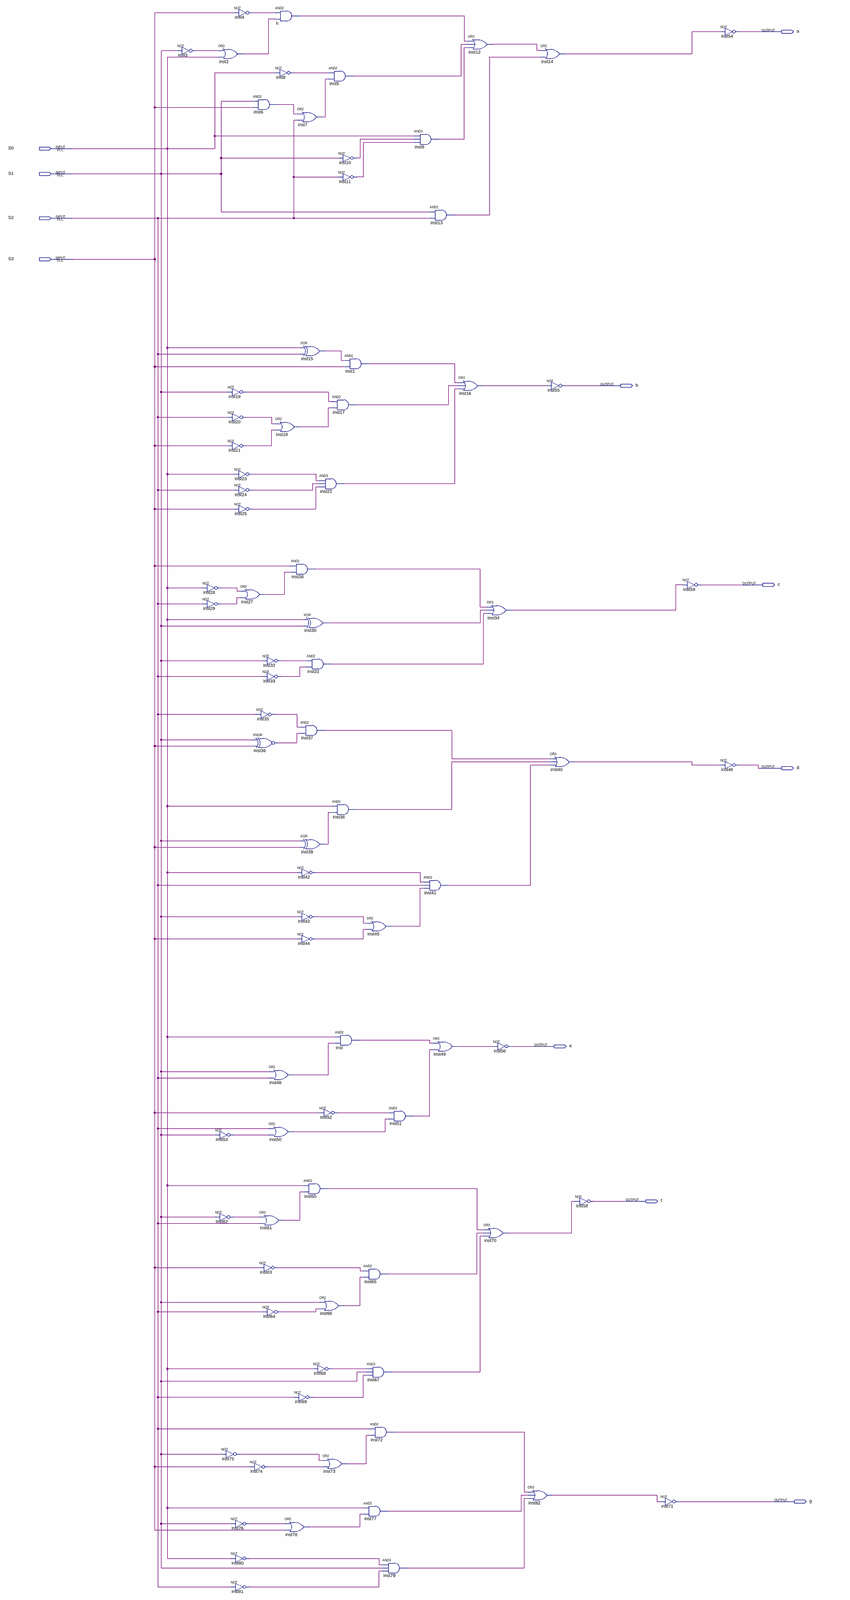
[diagram p0: schematic sheet, whole]
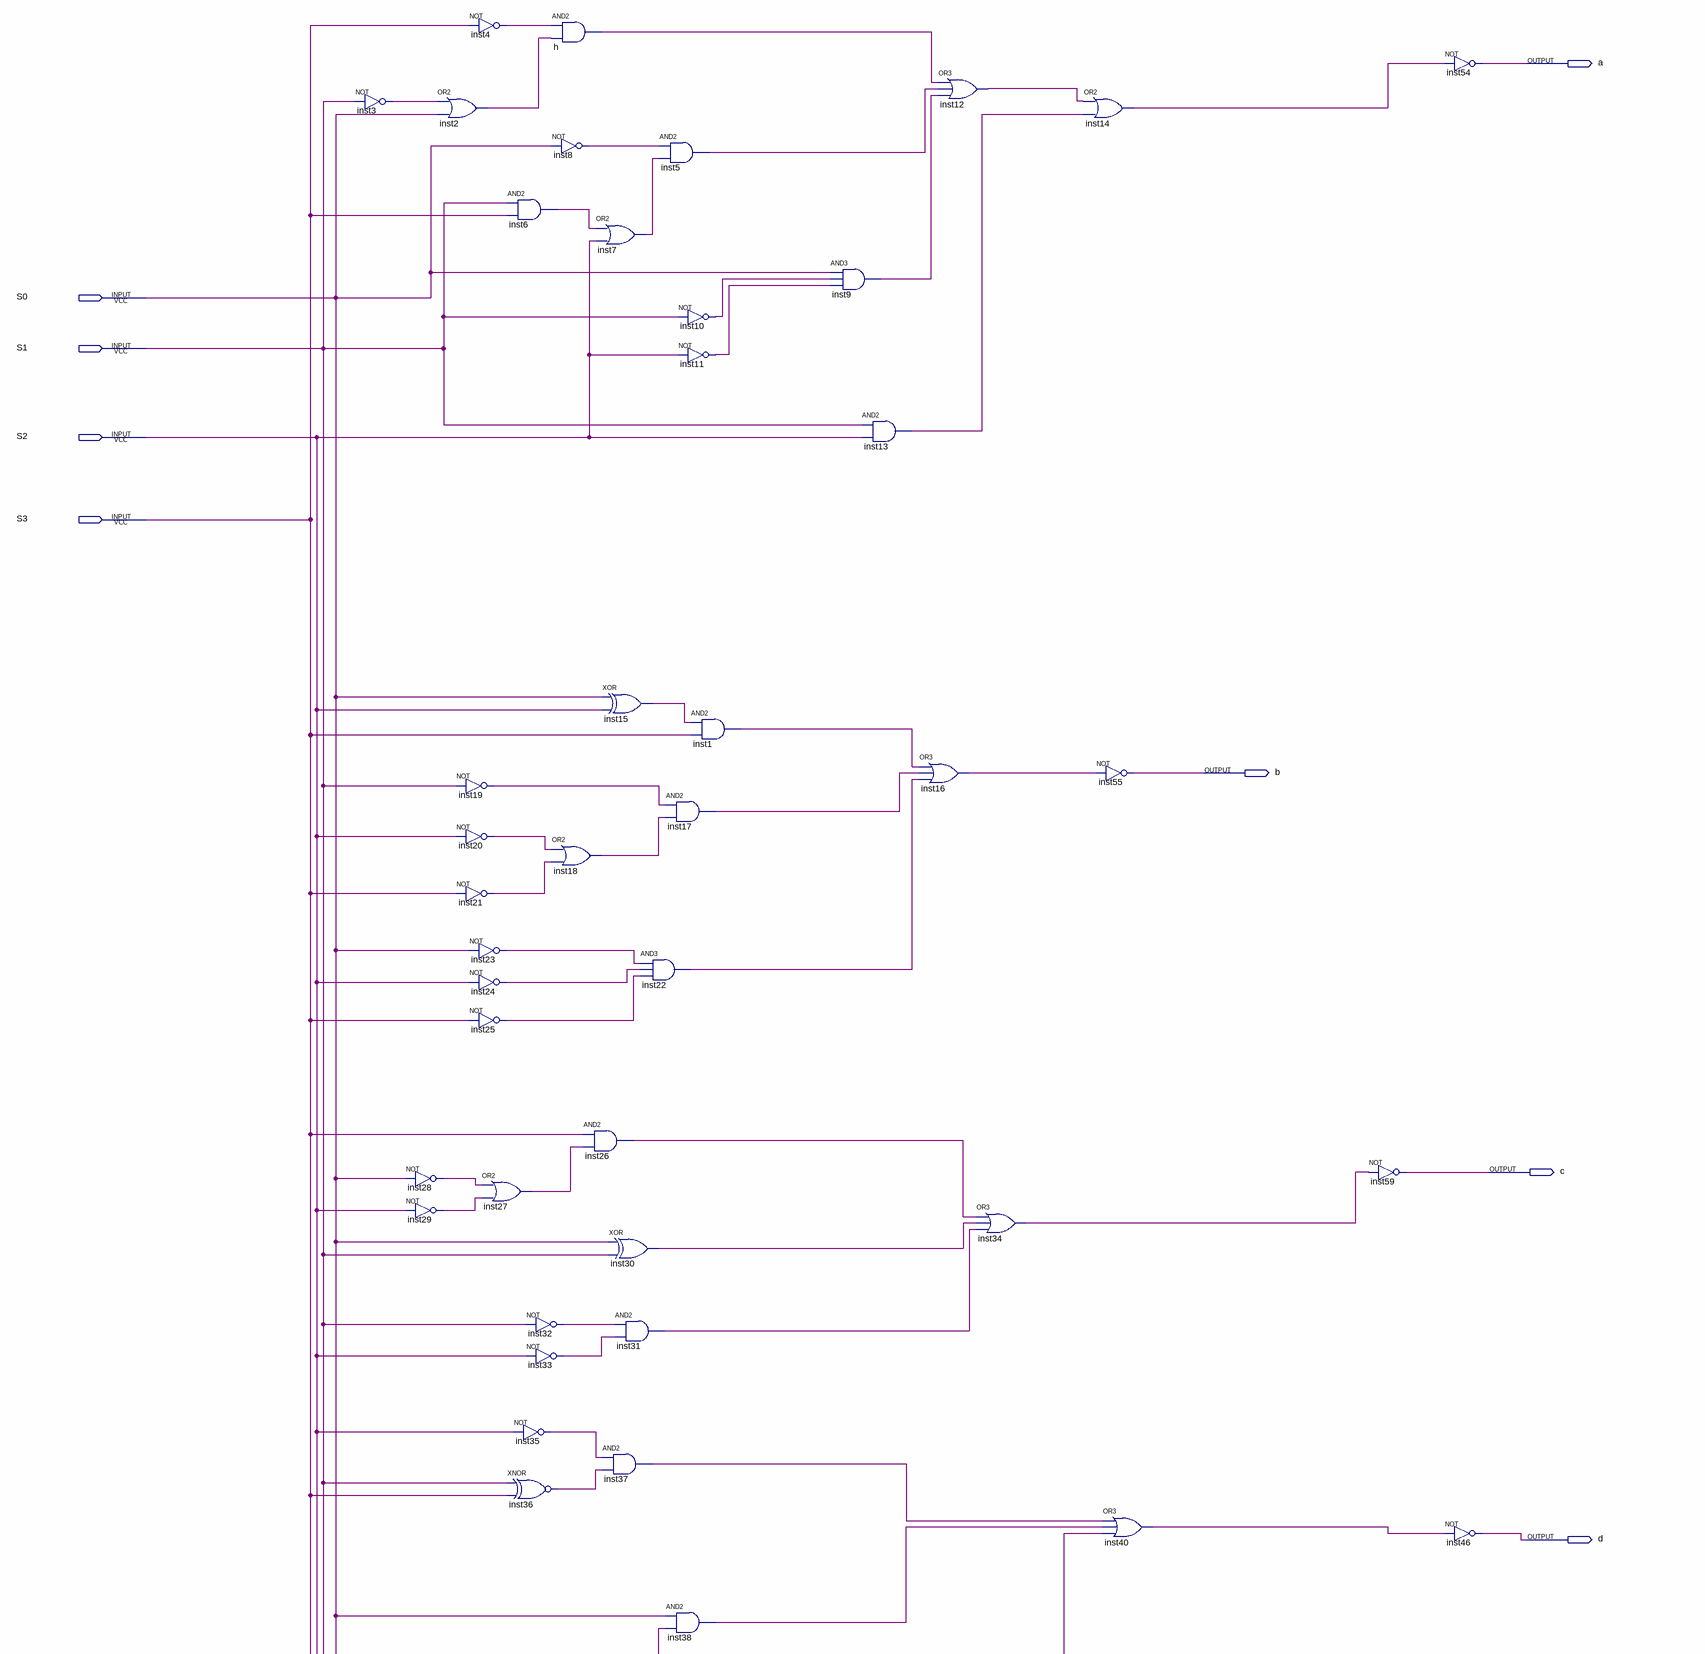
[diagram p1: schematic sheet, upper part]
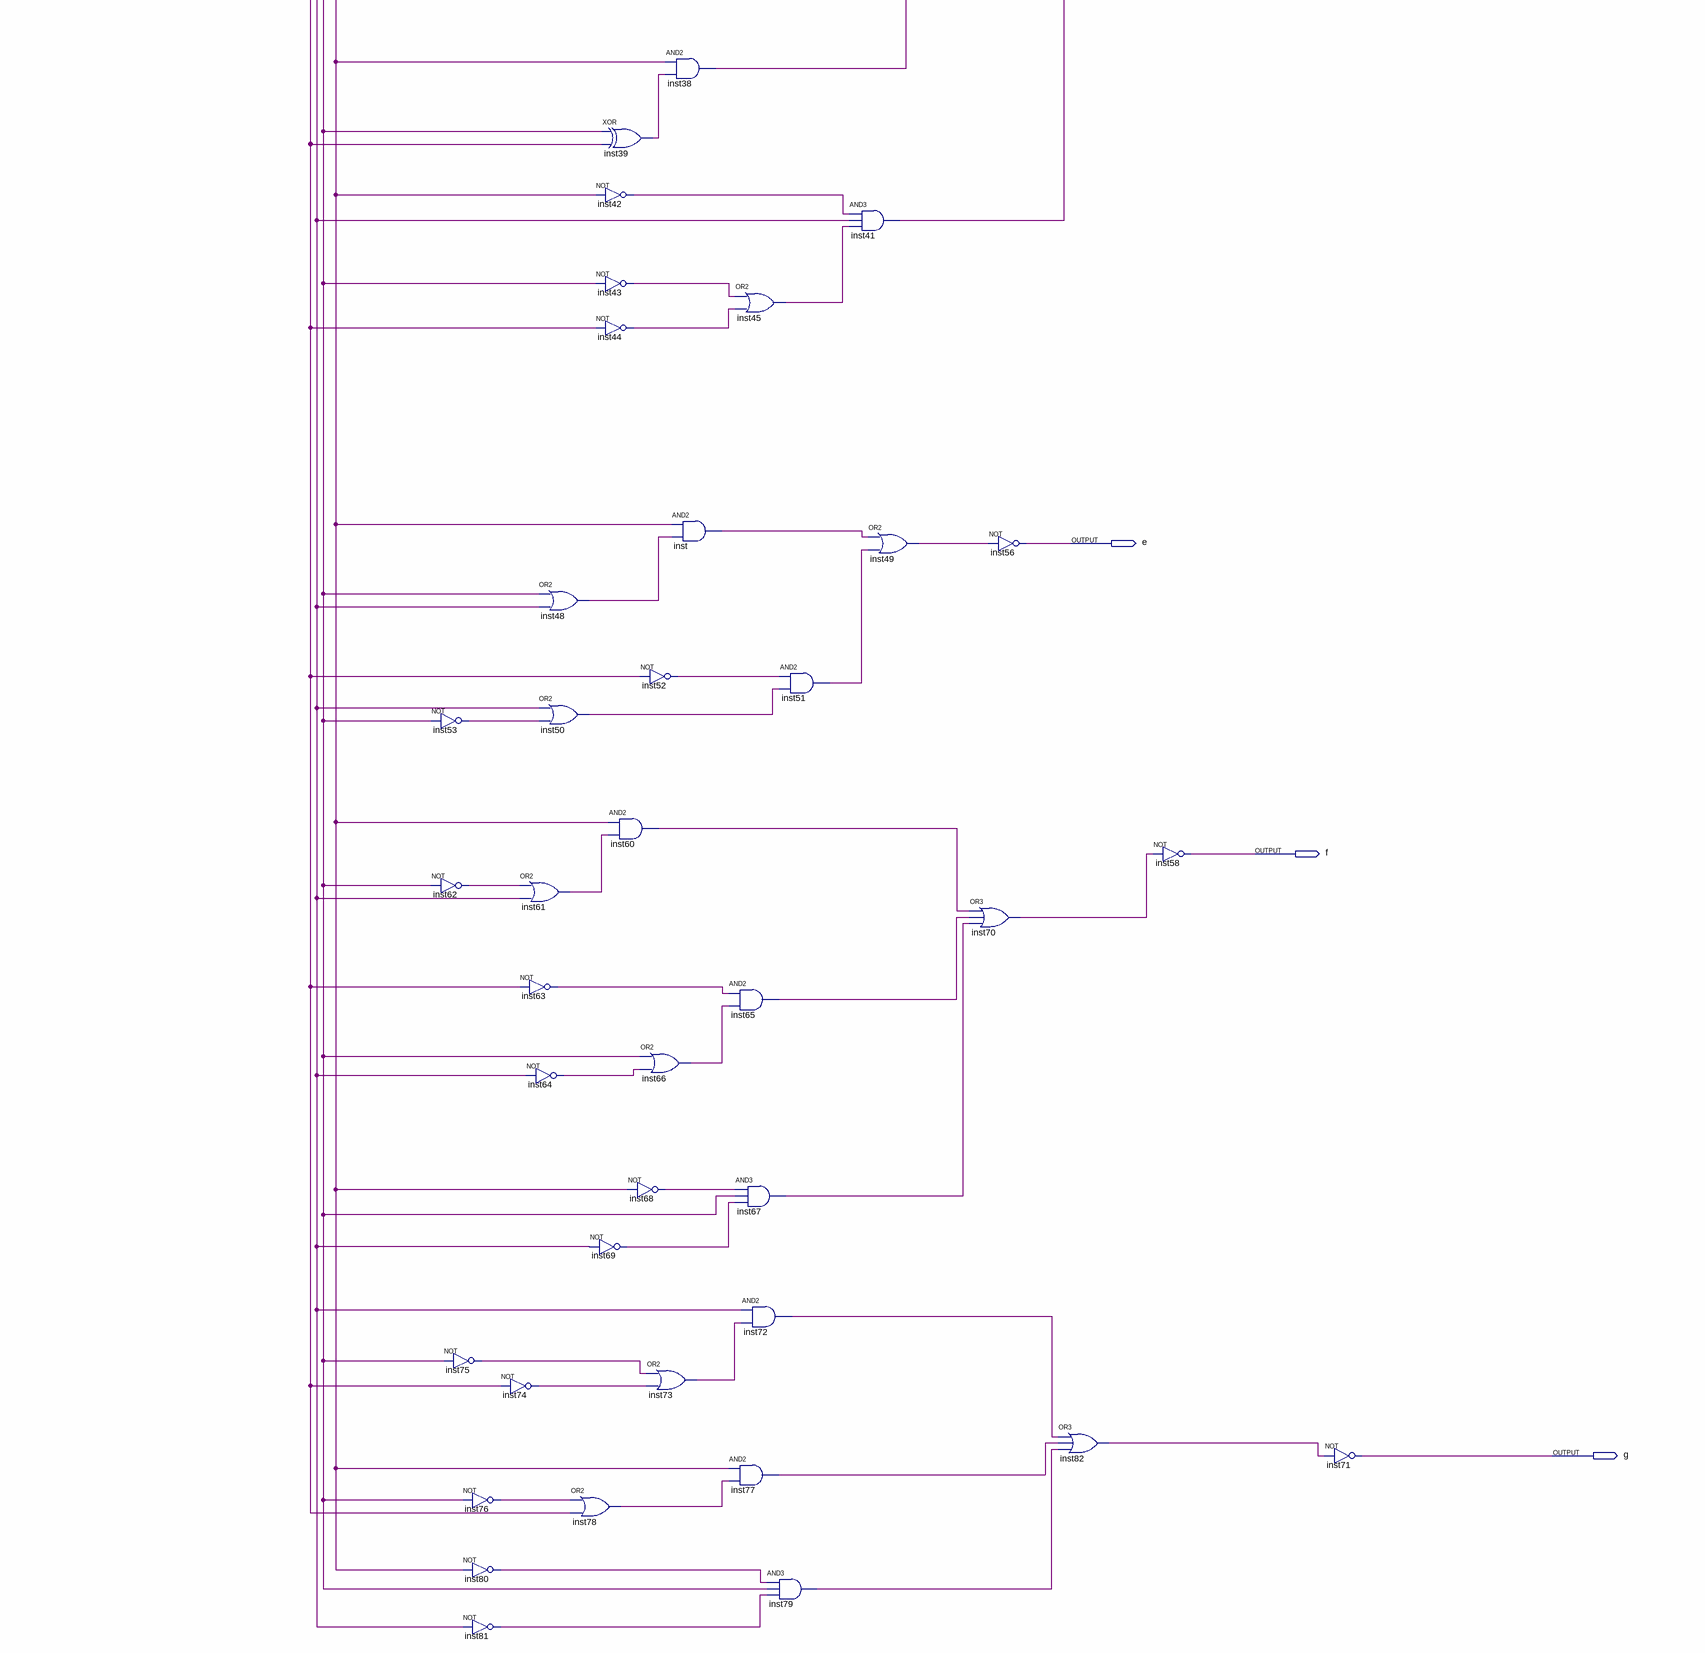
[diagram p2: schematic sheet, lower part]
// Quartus schematic aula04.bdf as structural Verilog: 82 symbols, 11 pins
module aula04 (
  input  S0,
  input  S1,
  input  S2,
  input  S3,
  output a,
  output b,
  output c,
  output d,
  output e,
  output f,
  output g
);

  wire h_out, inst1_out, inst2_out, inst3_out, inst4_out, inst5_out, inst6_out, inst7_out, inst8_out,
       inst9_out, inst10_out, inst11_out, inst12_out, inst13_out, inst14_out, inst15_out, inst16_out,
       inst17_out, inst18_out, inst19_out, inst20_out, inst21_out, inst22_out, inst23_out, inst24_out,
       inst25_out, inst26_out, inst27_out, inst28_out, inst29_out, inst30_out, inst31_out, inst32_out,
       inst33_out, inst34_out, inst35_out, inst36_out, inst37_out, inst38_out, inst39_out, inst40_out,
       inst41_out, inst42_out, inst43_out, inst44_out, inst45_out, inst48_out, inst49_out, inst50_out,
       inst51_out, inst52_out, inst53_out, inst60_out, inst61_out, inst62_out, inst63_out, inst64_out,
       inst65_out, inst66_out, inst67_out, inst68_out, inst69_out, inst70_out, inst72_out, inst73_out,
       inst74_out, inst75_out, inst76_out, inst77_out, inst78_out, inst79_out, inst80_out, inst81_out,
       inst82_out, inst_out;

  not inst3 (inst3_out, S1);
  not inst28 (inst28_out, S0);
  not inst29 (inst29_out, S2);
  or inst2 (inst2_out, inst3_out, S0);
  not inst19 (inst19_out, S1);
  not inst20 (inst20_out, S2);
  not inst21 (inst21_out, S3);
  not inst53 (inst53_out, S1);
  not inst62 (inst62_out, S1);
  not inst75 (inst75_out, S1);
  not inst4 (inst4_out, S3);
  and inst6 (inst6_out, S1, S3);
  not inst23 (inst23_out, S0);
  not inst24 (inst24_out, S2);
  not inst25 (inst25_out, S3);
  or inst27 (inst27_out, inst28_out, inst29_out);
  xnor inst36 (inst36_out, S1, S3);
  not inst74 (inst74_out, S3);
  not inst76 (inst76_out, S1);
  not inst80 (inst80_out, S0);
  not inst81 (inst81_out, S2);
  and h (h_out, inst4_out, inst2_out);
  not inst8 (inst8_out, S0);
  or inst18 (inst18_out, inst20_out, inst21_out);
  not inst32 (inst32_out, S1);
  not inst33 (inst33_out, S2);
  not inst35 (inst35_out, S2);
  or inst48 (inst48_out, S1, S2);
  or inst50 (inst50_out, S2, inst53_out);
  or inst61 (inst61_out, inst62_out, S2);
  not inst63 (inst63_out, S3);
  not inst64 (inst64_out, S2);
  or inst7 (inst7_out, inst6_out, S2);
  xor inst15 (inst15_out, S0, S2);
  and inst26 (inst26_out, S3, inst27_out);
  xor inst30 (inst30_out, S0, S1);
  and inst37 (inst37_out, inst35_out, inst36_out);
  xor inst39 (inst39_out, S1, S3);
  not inst42 (inst42_out, S0);
  not inst43 (inst43_out, S1);
  not inst44 (inst44_out, S3);
  and inst60 (inst60_out, S0, inst61_out);
  not inst69 (inst69_out, S2);
  or inst78 (inst78_out, inst76_out, S3);
  and inst5 (inst5_out, inst8_out, inst7_out);
  and inst22 (inst22_out, inst23_out, inst24_out, inst25_out);
  and inst31 (inst31_out, inst32_out, inst33_out);
  not inst52 (inst52_out, S3);
  or inst66 (inst66_out, S1, inst64_out);
  not inst68 (inst68_out, S0);
  or inst73 (inst73_out, inst75_out, inst74_out);
  not inst10 (inst10_out, S1);
  not inst11 (inst11_out, S2);
  and inst1 (inst1_out, inst15_out, S3);
  and inst17 (inst17_out, inst19_out, inst18_out);
  and inst38 (inst38_out, S0, inst39_out);
  and inst (inst_out, S0, inst48_out);
  or inst45 (inst45_out, inst43_out, inst44_out);
  and inst65 (inst65_out, inst63_out, inst66_out);
  and inst67 (inst67_out, inst68_out, S1, inst69_out);
  and inst72 (inst72_out, S2, inst73_out);
  and inst77 (inst77_out, S0, inst78_out);
  and inst51 (inst51_out, inst52_out, inst50_out);
  and inst79 (inst79_out, inst80_out, S1, inst81_out);
  and inst9 (inst9_out, S0, inst10_out, inst11_out);
  and inst13 (inst13_out, S1, S2);
  and inst41 (inst41_out, inst42_out, S2, inst45_out);
  or inst49 (inst49_out, inst_out, inst51_out);
  or inst12 (inst12_out, h_out, inst5_out, inst9_out);
  or inst16 (inst16_out, inst1_out, inst17_out, inst22_out);
  or inst34 (inst34_out, inst26_out, inst30_out, inst31_out);
  not inst56 (e, inst49_out);
  or inst70 (inst70_out, inst60_out, inst65_out, inst67_out);
  or inst82 (inst82_out, inst72_out, inst77_out, inst79_out);
  or inst14 (inst14_out, inst12_out, inst13_out);
  not inst55 (b, inst16_out);
  or inst40 (inst40_out, inst37_out, inst38_out, inst41_out);
  not inst58 (f, inst70_out);
  not inst59 (c, inst34_out);
  not inst71 (g, inst82_out);
  not inst54 (a, inst14_out);
  not inst46 (d, inst40_out);
endmodule
